# EasyEDA Pro project ProPrj_USB_CAN_Transceiver_Board_2026-08-12.epro

# Board PCB
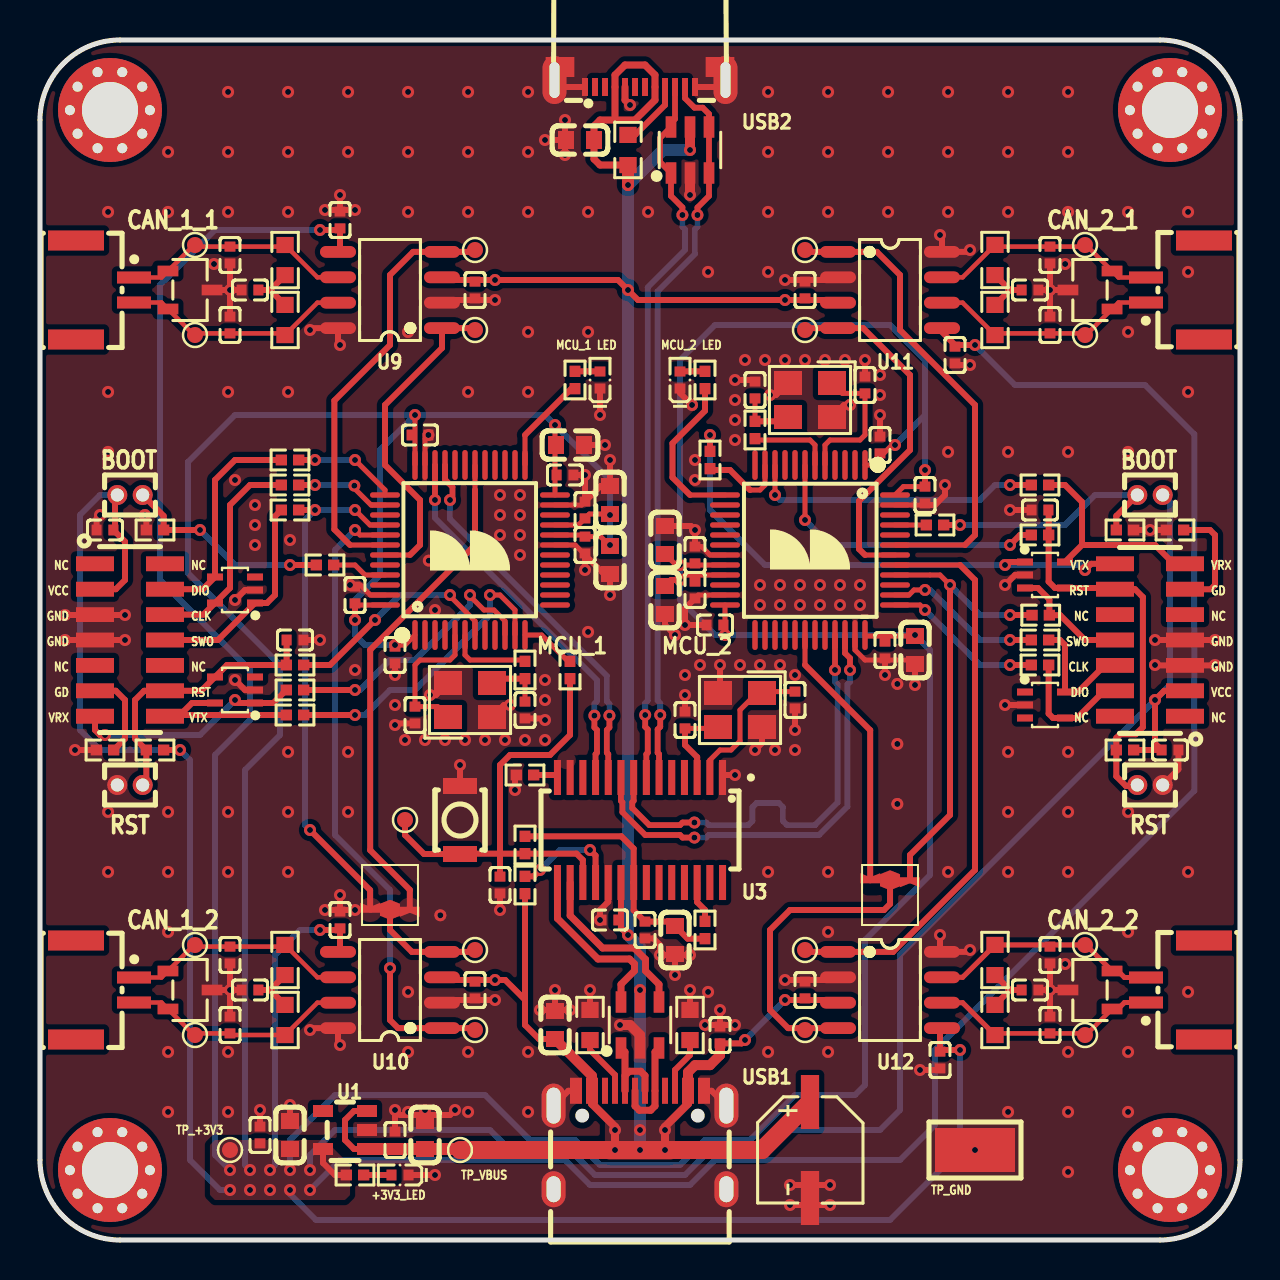
[diagram p0: board, top side]
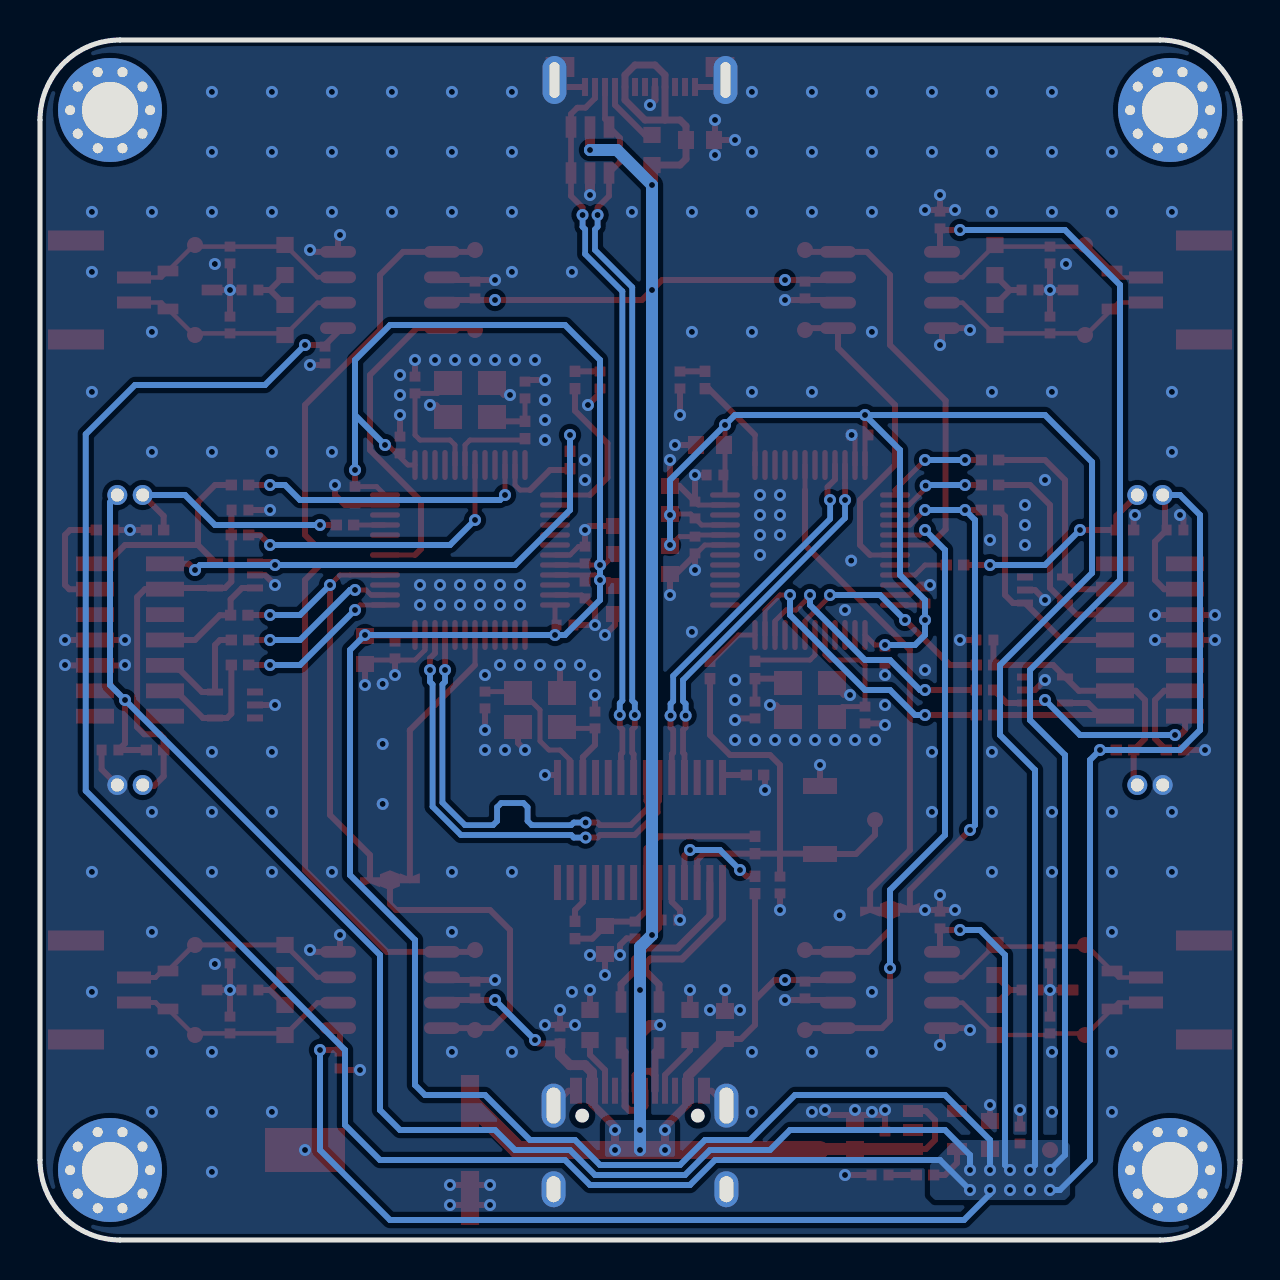
[diagram p1: board, bottom side, seen from below]

Outline 60 x 60 mm; copper layers: Top Layer, Inner1, Inner2, Bottom Layer. Coordinates in mm from the lower left corner of the outline.
Outline path: 0,56 0,4 arc(1.17,1.17) 4,0 56,0 arc(58.83,1.17) 60,4 60,56 arc(58.83,58.83) 56,60 4,60 arc(1.17,58.83) 0,56
Stack: Top Layer 0.035mm Outer layer thickness 1oz / Dielectric1 0.0994mm 3313 RC57% 4.2mil / Inner1 0.0152mm Inner layer thickness / Dielectric2 1.265mm 1.3mm H/HOZ Copper / Inner2 0.0152mm Inner layer thickness / Dielectric3 0.0994mm 3313 RC57% 4.2mil / Bottom Layer 0.035mm Outer layer thickness 1oz

## Design rules (mm)
net DP_P: DP_US
net DN_N: DP_US
net USB_D-: DP_US_PROT
net USB_D+: DP_US_PROT
net FE11S_DP3: DP_DS_3
net FE11S_DM3: DP_DS_3
net FE11S_DM1: DP_DS_1
net FE11S_DP1: DP_DS_1
net FE11S_DP2: DP_DS_2
net FE11S_DM2: DP_DS_2
net CAN_1_H_1: DP_CAN_1
net CAN_1_L_1: DP_CAN_1
net CAN_1_H_2: DP_CAN_2
net CAN_1_L_2: DP_CAN_2
net CAN_2_H_1: DP_CAN_3
net CAN_2_L_1: DP_CAN_3
net CAN_2_H_2: DP_CAN_4
net CAN_2_L_2: DP_CAN_4
template: Custom Config
spacing copperThickness1oz (default): track to track 0.127, other pairs 0.152 to 0.3
spacing copperThickness2oz: track to track 0.203, other pairs 0.152 to 0.3
track width copperThickness1oz (default): min 0.203, default 0.3, max 2.54
track width copperThickness2oz: min 0.203, default 0.254, max 2.54
differential pair DP_USB_90 (default): width min 0.127, default 0.291, max 2.54; gap min 0.152, default 0.203
differential pair DP_CAN_120: width min 0.127, default 0.224, max 2.54; gap min 0.152, default 2.54
via viaSize (default): diameter min 0.5, default 0.6, max 10; hole min 0.3, default 0.3, max 6.3
net CAN_1_H_1 uses DP_CAN_120
net CAN_1_L_1 uses DP_CAN_120
net CAN_1_H_2 uses DP_CAN_120
net CAN_1_L_2 uses DP_CAN_120
net CAN_2_H_1 uses DP_CAN_120
net CAN_2_L_1 uses DP_CAN_120
net CAN_2_H_2 uses DP_CAN_120
net CAN_2_L_2 uses DP_CAN_120
diff pair DP_CAN_1 uses DP_CAN_120
diff pair DP_CAN_2 uses DP_CAN_120
diff pair DP_CAN_3 uses DP_CAN_120
diff pair DP_CAN_4 uses DP_CAN_120

## Placement (name value [footprint] x y rotation side)
C1  10uF  [C0603]  19.25 5.25 270 top
C2  100nF  [C0402]  17.75 5 270 top
C3  10uF  [C0603]  12.5 5.25 270 top
C4  100nF  [C0402]  11 5.25 270 top
C5  100uF  [CAP-SMD_BD5.0-L5.3-W5.3-LS6.3-FD]  38.5 4.5 270 top
C6  10uF  [C0603]  25.75 10.75 270 top
C7  100nF  [C0402]  34 10.25 270 top
C8  100nF  [C0402]  28.5 16 0 top
C9  10uF  [C0603]  31.75 15 90 top
C10  100nF  [C0402]  30.25 15.5 90 top
C11  20pF  [C0402]  32.25 26 270 top
C12  20pF  [C0402]  37.75 27 90 top
C13  100nF  [C0402]  23 17.75 90 top
C14  10uF  [C0603]  27 55 0 top
C15  4.7uF  [C0603]  26.5 39.75 0 top
C16  100nF  [C0402]  26.25 38.25 180 top
C17  100nF  [C0402]  19 40.25 180 top
C18  100nF  [C0402]  15.75 32.25 270 top
C19  100nF  [C0402]  17.75 29.25 90 top
C20  1uF  [C0603]  28.5 37 270 top
C21  10nF  [C0402]  27.25 36.5 270 top
C22  1uF  [C0603]  28.5 34 90 top
C23  100nF  [C0402]  27.25 34.75 90 top
C24  100nF  [C0402]  12.75 30 180 top
C25  100nF  [C0402]  3.25 35.5 0 top
C26  20pF  [C0402]  18.75 26.25 90 top
C27  20pF  [C0402]  24.25 26.5 90 top
C28  4.7uF  [C0603]  43.75 29.5 270 top
C29  100nF  [C0402]  44.25 37.25 90 top
C30  100nF  [C0402]  42.25 29.5 90 top
C31  100nF  [C0402]  33.75 30.75 0 top
C32  100nF  [C0402]  42 39.75 270 top
C33  1uF  [C0603]  31.25 32 90 top
C34  10nF  [C0402]  32.75 32.5 90 top
C35  1uF  [C0603]  31.25 35 270 top
C36  100nF  [C0402]  32.75 34.25 270 top
C37  100nF  [C0402]  50 36.5 0 top
C38  100nF  [C0402]  56.5 24.5 180 top
C39  20pF  [C0402]  41.25 42.75 270 top
C40  20pF  [C0402]  35.75 42.5 270 top
C41  4.7pF  [C0402]  9.5 45.75 270 top
C42  100nF  [C0402]  21.75 47.5 90 top
C43  100nF  [C0402]  15 51 270 top
C44  4.7nF  [C0402]  10.5 47.5 0 top
C45  4.7pF  [C0402]  9.5 49.25 270 top
C46  4.7pF  [C0402]  9.5 10.75 270 top
C47  100nF  [C0402]  21.75 12.5 90 top
C48  100nF  [C0402]  15 16 270 top
C49  4.7nF  [C0402]  10.5 12.5 0 top
C50  4.7pF  [C0402]  9.5 14.25 270 top
C51  4.7pF  [C0402]  50.5 49.25 90 top
C52  100nF  [C0402]  38.25 47.5 270 top
C53  100nF  [C0402]  45.75 44.25 90 top
C54  4.7nF  [C0402]  49.5 47.5 180 top
C55  4.7pF  [C0402]  50.5 45.75 90 top
C56  4.7pF  [C0402]  50.5 14.25 90 top
C57  100nF  [C0402]  38.25 12.5 270 top
C58  100nF  [C0402]  45 9 90 top
C59  4.7nF  [C0402]  49.5 12.5 180 top
C60  4.7pF  [C0402]  50.5 10.75 90 top
CN1  RH-5019  [TESTPOINT-SMD_L3.8-W2.0_RH-5019]  46.75 4.5 0 top
CN2  WAFER-GH1.25-2PWB  [CONN-TH_2P-P1.25_XUNPU_WAFER-GH1.25-2PWB]  3.25 47.5 270 top
CN3  WAFER-GH1.25-2PWB  [CONN-TH_2P-P1.25_XUNPU_WAFER-GH1.25-2PWB]  3.25 12.5 270 top
CN4  WAFER-GH1.25-2PWB  [CONN-TH_2P-P1.25_XUNPU_WAFER-GH1.25-2PWB]  56.75 47.5 90 top
CN5  WAFER-GH1.25-2PWB  [CONN-TH_2P-P1.25_XUNPU_WAFER-GH1.25-2PWB]  56.75 12.5 90 top
D1  USBLC6-2SC6  [SOT-23-6_L2.9-W1.6-P0.95-LS2.8-BL]  30 10.75 0 top
D2  USBLC6-2SC6  [SOT-23-6_L2.9-W1.6-P0.95-LS2.8-BL]  32.5 54.5 0 top
D3  ESDALC6V1W5  [SOT-323-5_L2.0-W1.3-LS2.1-BL]  9.75 27.5 90 top
D4  ESDALC6V1W5  [SOT-323-5_L2.0-W1.3-LS2.1-BL]  9.75 32.5 90 top
D5  ESDALC6V1W5  [SOT-323-5_L2.0-W1.3-LS2.1-BL]  50.25 33.25 270 top
D6  ESDALC6V1W5  [SOT-323-5_L2.0-W1.3-LS2.1-BL]  50.25 26.75 270 top
D7  PESD2CANFD24V-TR  [SOT-23-3_L3.0-W1.7-P0.95-LS2.9-BR]  7.5 47.5 180 top
D8  PESD2CANFD24V-TR  [SOT-23-3_L3.0-W1.7-P0.95-LS2.9-BR]  7.5 12.5 180 top
D9  PESD2CANFD24V-TR  [SOT-23-3_L3.0-W1.7-P0.95-LS2.9-BR]  52.5 47.5 0 top
D10  PESD2CANFD24V-TR  [SOT-23-3_L3.0-W1.7-P0.95-LS2.9-BR]  52.5 12.5 0 top
H1  ZX-PZ1.27-1-2PZZ  [HDR-TH_2P-P1.27-V-M-2]  4.5 22.75 180 top
H2  ZX-PZ1.27-1-2PZZ  [HDR-TH_2P-P1.27-V-M-2]  4.5 37.25 0 top
H3  ZX-PZ1.27-1-2PZZ  [HDR-TH_2P-P1.27-V-M-2]  55.5 22.75 0 top
H4  ZX-PZ1.27-1-2PZZ  [HDR-TH_2P-P1.27-V-M-2]  55.5 37.25 180 top
J1  STLINK-V3MINI_STDC14  [HDR-SMD_14P-P1.27-V-M-R2-C7-LS5.3-1]  4.5 30 270 top
J2  STLINK-V3MINI_STDC14  [HDR-SMD_14P-P1.27-V-M-R2-C7-LS5.3-1]  55.5 30 90 top
K1  Jumper-3Pos-SMD  [JMP_ARROW_3PIN_SPECIFIC_CUSTOMIZATION]  17.5 17.25 90 top
K2  Jumper-3Pos-SMD  [JMP_ARROW_3PIN_SPECIFIC_CUSTOMIZATION]  42.5 17.25 270 top
LED1  XL-1005UGC  [LED0402-RD_GREEN]  18 3.25 180 top
MCU_1  STM32G474CET6  [LQFP-48_L7.0-W7.0-P0.50-LS9.0-BL]  21.5 34.5 0 top
MCU_2  STM32G474CET6  [LQFP-48_L7.0-W7.0-P0.50-LS9.0-BL]  38.5 34.5 180 top
R1  1kΩ  [R0402]  15.75 3.25 0 top
R2  5.1kΩ  [R0603]  27.5 10.75 90 top
R3  5.1kΩ  [R0603]  32.5 10.75 270 top
R4  10kΩ  [R0402]  33.25 15.5 90 top
R5  10kΩ  [R0402]  24.25 19.75 90 top
R6  1kΩ  [R0402]  26.5 28.5 90 top
R7  1kΩ  [R0402]  24.25 17.75 270 top
R8  2.7kΩ  [R0402]  24.25 23.25 0 top
R9  56kΩ  [R0603]  29.4 54.5 270 top
R10  10kΩ  [R0402]  5.75 24.5 0 top
R11  47Ω  [R0402]  14.25 33.75 180 top
R12  10kΩ  [R0402]  5.75 35.5 0 top
R13  100Ω  [R0402]  3.25 24.5 0 top
R14  47Ω  [R0402]  12.75 27.5 180 top
R15  47Ω  [R0402]  12.75 26.25 180 top
R16  47Ω  [R0402]  12.75 28.75 180 top
R17  1kΩ  [R0402]  26.75 43 270 top
R18  47Ω  [R0402]  12.5 36.5 180 top
R19  47Ω  [R0402]  12.5 39 180 top
R20  47Ω  [R0402]  12.5 37.75 180 top
R21  0Ω  [R0402]  24.25 28.5 90 top
R22  10kΩ  [R0402]  54.25 24.5 0 top
R23  47Ω  [R0402]  44.75 35.75 0 top
R24  10kΩ  [R0402]  54.25 35.5 180 top
R25  100Ω  [R0402]  56.75 35.5 0 top
R26  1kΩ  [R0402]  33.25 43 90 top
R27  47Ω  [R0402]  50.04 31.24 0 top
R28  47Ω  [R0402]  33.5 39 90 top
R29  47Ω  [R0402]  50 35.25 0 top
R30  47Ω  [R0402]  50 37.75 0 top
R31  47Ω  [R0402]  50 28.75 0 top
R32  47Ω  [R0402]  50 30 0 top
R33  0Ω  [R0402]  35.75 40.5 270 top
R34  60.4Ω  [R0603]  12.25 46 270 top
R35  60.4Ω  [R0603]  12.25 49 270 top
R36  60.4Ω  [R0603]  12.25 11 270 top
R37  60.4Ω  [R0603]  12.25 14 270 top
R38  60.4Ω  [R0603]  47.75 49 90 top
R39  60.4Ω  [R0603]  47.75 46 90 top
R40  60.4Ω  [R0603]  47.75 14 90 top
R41  60.4Ω  [R0603]  47.75 11 90 top
SW1  B3U-1000P  [KEY-SMD_B3U-1000PM]  21 21 90 top
TP1  -  [TESTPOINT_0.8MM]  21 4.5 0 top
TP2  -  [TESTPOINT_0.8MM]  9.5 4.5 0 top
TP3  -  [TESTPOINT_0.8MM]  18.25 21 0 top
TP4  -  [TESTPOINT_0.8MM]  21.75 45.5 180 top
TP5  -  [TESTPOINT_0.8MM]  7.75 45.25 0 top
TP6  -  [TESTPOINT_0.8MM]  21.75 49.5 180 top
TP7  -  [TESTPOINT_0.8MM]  7.75 49.75 0 top
TP8  -  [TESTPOINT_0.8MM]  21.75 10.5 0 top
TP9  -  [TESTPOINT_0.8MM]  7.75 10.25 0 top
TP10  -  [TESTPOINT_0.8MM]  21.75 14.5 0 top
TP11  -  [TESTPOINT_0.8MM]  7.75 14.75 0 top
TP12  -  [TESTPOINT_0.8MM]  38.25 49.5 0 top
TP13  -  [TESTPOINT_0.8MM]  52.25 49.75 0 top
TP14  -  [TESTPOINT_0.8MM]  38.25 45.5 0 top
TP15  -  [TESTPOINT_0.8MM]  52.25 45.25 0 top
TP16  -  [TESTPOINT_0.8MM]  38.25 14.5 0 top
TP17  -  [TESTPOINT_0.8MM]  52.25 14.75 0 top
TP18  -  [TESTPOINT_0.8MM]  38.25 10.5 0 top
TP19  -  [TESTPOINT_0.8MM]  52.25 10.25 0 top
U1  TLV75733PDBVR  [SOT-23-5_L2.9-W1.6-P0.95-LS2.8-BL]  15.25 5.5 90 top
U3  FE1.1S-BSOP28BCN  [SSOP-28_L9.9-W3.9-P0.635-LS6.0-BL-1]  30 20.5 180 top
U6  XL-1005UBC  [LED0402-RD_GREEN]  28 43 90 top
U8  XL-1005UBC  [LED0402-RD_GREEN]  32 43 90 top
U9  TCAN1044AVDRQ1  [SOIC-8_L4.9-W3.9-P1.27-LS6.0-BL]  17.5 47.5 90 top
U10  TCAN1044AVDRQ1  [SOIC-8_L4.9-W3.9-P1.27-LS6.0-BL]  17.5 12.5 90 top
U11  TCAN1044AVDRQ1  [SOIC-8_L4.9-W3.9-P1.27-LS6.0-BL]  42.5 47.5 270 top
U12  TCAN1044AVDRQ1  [SOIC-8_L4.9-W3.9-P1.27-LS6.0-BL]  42.5 12.5 270 top
U14  -  [M2.5]  3.49 3.49 0 top
U15  -  [M2.5]  56.49 3.49 0 top
U16  -  [M2.5]  3.49 56.49 0 top
U17  -  [M2.5]  56.49 56.49 0 top
USB1  U262-161N-4BVC11  [USB-3.1-SMD_U262-161N-4BVC11]  30 5 0 top
USB2  U261-121N-4BS2S  [USB-C-SMD_U261-121N-4BS2S]  30 58.15 180 top
X1  12MHz  [CRYSTAL-SMD_4P-L3.2-W2.5-BL]  35 26.5 180 top
X2  8MHz  [CRYSTAL-SMD_4P-L3.2-W2.5-BL]  21.5 27 0 top
X3  8MHz  [CRYSTAL-SMD_4P-L3.2-W2.5-BL]  38.5 42 180 top

## Footprints (pads in the part's own frame, mm; a bottom-side part is the same pattern mirrored in y, then rotated)
C0402
  rect 0.5x0.54 smd: 1(-0.42,0) 2(0.42,0)
C0603
  rect 0.8x0.9 smd: 1(-0.7,0) 2(0.7,0)
CAP-SMD_BD5.0-L5.3-W5.3-LS6.3-FD
  rect 2.7x0.91 smd: 1(-2.4,0) 2(2.4,0)
CONN-TH_2P-P1.25_XUNPU_WAFER-GH1.25-2PWB
  rect 0.6x1.7 smd: 1(-0.625,1.45) 2(0.625,1.45)
  rect 1x2.8 smd: 3(-2.475,-1.45) 4(2.475,-1.45)
CRYSTAL-SMD_4P-L3.2-W2.5-BL
  rect 1.4x1.2 smd: 1(-1.1,-0.85) 2(1.1,-0.85) 3(1.1,0.85) 4(-1.1,0.85)
HDR-SMD_14P-P1.27-V-M-R2-C7-LS5.3-1
  rect 0.74x1.9 smd: 1(-3.81,-1.75) 2(-3.81,1.75) 3(-2.54,-1.75) 4(-2.54,1.75) 5(-1.27,-1.75) 6(-1.27,1.75) 7(0,-1.75) 8(0,1.75) 9(1.27,-1.75) 10(1.27,1.75) 11(2.54,-1.75) 12(2.54,1.75) 13(3.81,-1.75) 14(3.81,1.75)
HDR-TH_2P-P1.27-V-M-2
  round 1 hole 0.65: 1(-0.635,0) 2(0.635,0)
JMP_ARROW_3PIN_SPECIFIC_CUSTOMIZATION
  custom 0.5x1 smd: 1(-0.738,0.995) 3(-0.738,-0.992)
  custom 1x1 smd: 2(-0.738,0.002)
KEY-SMD_B3U-1000PM
  rect 0.8x1.7 smd: 1(-1.7,0) 2(1.7,0)
LED0402-RD_GREEN
  rect 0.5x0.54 smd: 1(-0.425,0) 2(0.425,0)
LQFP-48_L7.0-W7.0-P0.50-LS9.0-BL
  oval 0.27x1.5 smd: 1(-2.75,-4.25) 2(-2.25,-4.25) 3(-1.75,-4.25) 4(-1.25,-4.25) 5(-0.75,-4.25) 6(-0.25,-4.25) 7(0.25,-4.25) 8(0.75,-4.25) 9(1.25,-4.25) 10(1.75,-4.25) 11(2.25,-4.25) 12(2.75,-4.25) 25(2.75,4.25) 26(2.25,4.25) 27(1.75,4.25) 28(1.25,4.25) 29(0.75,4.25) 30(0.25,4.25) 31(-0.25,4.25) 32(-0.75,4.25) 33(-1.25,4.25) 34(-1.75,4.25) 35(-2.25,4.25) 36(-2.75,4.25)
  oval 1.5x0.27 smd: 13(4.25,-2.75) 14(4.25,-2.25) 15(4.25,-1.75) 16(4.25,-1.25) 17(4.25,-0.75) 18(4.25,-0.25) 19(4.25,0.25) 20(4.25,0.75) 21(4.25,1.25) 22(4.25,1.75) 23(4.25,2.25) 24(4.25,2.75) 37(-4.25,2.75) 38(-4.25,2.25) 39(-4.25,1.75) 40(-4.25,1.25) 41(-4.25,0.75) 42(-4.25,0.25) 43(-4.25,-0.25) 44(-4.25,-0.75) 45(-4.25,-1.25) 46(-4.25,-1.75) 47(-4.25,-2.25) 48(-4.25,-2.75)
M2.5
  round 1 hole 0.5: 1(-2,0) 1(-1.618,1.175) 1(-1.618,-1.175) 1(-0.618,1.902) 1(-0.618,-1.902) 1(0.618,1.902) 1(0.618,-1.902) 1(1.618,1.175) 1(1.618,-1.175) 1(2,0)
  round 5.2 hole 2.8: 1(0.005,0.009)
R0402
  rect 0.566x0.54 smd: 1(-0.433,0) 2(0.433,0)
R0603
  rect 0.806x0.864 smd: 1(-0.753,0) 2(0.753,0)
SOIC-8_L4.9-W3.9-P1.27-LS6.0-BL
  oval 0.588x1.8 smd: 1(-1.905,-2.6) 2(-0.635,-2.6) 3(0.635,-2.6) 4(1.905,-2.6) 5(1.905,2.6) 6(0.635,2.6) 7(-0.635,2.6) 8(-1.905,2.6)
SOT-23-3_L3.0-W1.7-P0.95-LS2.9-BR
  rect 1.038x0.532 smd: 1(1.101,-0.95) 2(1.101,0.95) 3(-1.101,0)
SOT-23-5_L2.9-W1.6-P0.95-LS2.8-BL
  rect 0.6x1 smd: 1(-0.95,-1.1) 2(0,-1.1) 3(0.95,-1.1) 4(0.95,1.1) 5(-0.95,1.1)
SOT-23-6_L2.9-W1.6-P0.95-LS2.8-BL
  rect 0.532x1.072 smd: 1(-0.95,-1.149) 2(0,-1.149) 3(0.95,-1.149) 4(0.95,1.149) 5(0,1.149) 6(-0.95,1.149)
SOT-323-5_L2.0-W1.3-LS2.1-BL
  rect 0.35x0.8 smd: 1(-0.651,-1) 2(-0.001,-1) 3(0.649,-1) 4(0.651,1) 5(-0.649,1)
SSOP-28_L9.9-W3.9-P0.635-LS6.0-BL-1
  rect 0.35x1.751 smd: 1(-4.128,-2.626) 2(-3.493,-2.626) 3(-2.857,-2.626) 4(-2.223,-2.626) 5(-1.587,-2.626) 6(-0.953,-2.626) 7(-0.318,-2.626) 8(0.318,-2.626) 9(0.953,-2.626) 10(1.587,-2.626) 11(2.223,-2.626) 12(2.857,-2.626) 13(3.493,-2.626) 14(4.128,-2.626) 15(4.128,2.626) 16(3.493,2.626) 17(2.857,2.626) 18(2.223,2.626) 19(1.587,2.626) 20(0.953,2.626) 21(0.318,2.626) 22(-0.318,2.626) 23(-0.953,2.626) 24(-1.587,2.626) 25(-2.223,2.626) 26(-2.857,2.626) 27(-3.493,2.626) 28(-4.128,2.626)
TESTPOINT-SMD_L3.8-W2.0_RH-5019
  rect 4x2.2 smd: 1(0,0)
TESTPOINT_0.8MM
  round 0.8 smd: 1(0,0)
USB-3.1-SMD_U262-161N-4BVC11
  oval 1.2x2.2 hole 0.7x1.8: 13(4.32,1.719) 16(-4.32,1.719)
  oval 1.2x1.8 hole 0.7x1.3: 14(4.32,-2.462) 15(-4.32,-2.462)
  rect 0.6x1.3 smd: A1B12(-3.2,2.462) A4B9(-2.4,2.462) B1A12(3.2,2.462) B4A9(2.4,2.462)
  rect 0.3x1.3 smd: A5(-1.25,2.462) A6(-0.25,2.462) A7(0.25,2.462) A8(1.25,2.462) B5(1.75,2.462) B6(0.75,2.462) B7(-0.75,2.462) B8(-1.75,2.462)
USB-C-SMD_U261-121N-4BS2S
  oval 1.2x2.4 hole 0.5x1.8: 25(-4.275,0.15) 26(4.275,0.15)
  rect 1.43x1 smd: 25(-4,-0.5) 26(4,-0.5)
  rect 0.3x0.9 smd: A1(2.75,0.5) A2(2.25,0.5) A3(1.75,0.5) A4(1.25,0.5) A5(-1.25,0.5) A6(-1.75,0.5) A7(-2.25,0.5) A12(-2.75,0.5) B9(-0.75,0.5) B10(-0.25,0.5) B11(0.25,0.5) B12(0.75,0.5)

## Nets
+3V3: C3.2 C4.2 C15.1 C16.2 C17.2 C18.2 C19.2 C20.2 C21.2 C22.2 C23.2 C25.2 C28.1 C29.2 C30.2 C31.2 C32.2 C33.2 C34.2 C35.2 C36.2 C38.2 C43.2 C48.2 C53.2 C58.2 H2.1 H4.1 J1.3 J2.3 MCU_1.1 MCU_1.20 MCU_1.21 MCU_1.24 MCU_1.36 MCU_1.48 MCU_2.1 MCU_2.20 MCU_2.21 MCU_2.24 MCU_2.36 MCU_2.48 R1.1 R10.2 R22.2 TP2.1 U1.5 U9.5 U10.5 U11.5 U12.5
+3V3_FE11S: C9.2 C10.2 R4.1 R5.2 U3.21
GND: C1.1 C2.1 C3.1 C4.1 C5.2 C6.1 C7.1 C8.1 C9.1 C10.1 C11.1 C12.1 C13.1 C14.1 C15.2 C16.1 C17.1 C18.1 C19.1 C20.1 C21.1 C22.1 C23.1 C24.1 C25.1 C26.1 C27.1 C28.2 C29.1 C30.1 C31.1 C32.1 C33.1 C34.1 C35.1 C36.1 C37.1 C38.1 C39.1 C40.1 C41.1 C42.1 C43.1 C44.1 C45.2 C46.1 C47.1 C48.1 C49.1 C50.2 C51.1 C52.1 C53.1 C54.1 C55.2 C56.1 C57.1 C58.1 C59.1 C60.2 CN1.1 D1.2 D2.2 D3.2 D4.2 D5.2 D6.2 D7.3 D8.3 D9.3 D10.3 H1.2 H3.2 J1.5 J1.7 J2.5 J2.7 LED1.1 MCU_1.19 MCU_1.23 MCU_1.35 MCU_1.47 MCU_2.19 MCU_2.23 MCU_2.35 MCU_2.47 R2.2 R3.1 R8.1 R12.1 R13.1 R24.1 R25.1 SW1.2 U1.2 U3.1 U3.19 U6.1 U8.1 U9.2 U9.8 U10.2 U10.8 U11.2 U11.8 U12.2 U12.8 USB1.13 USB1.14 USB1.15 USB1.16 USB1.A1B12 USB1.B1A12 USB2.25 USB2.26 USB2.A1 USB2.A12 USB2.B12 X1.2 X1.4 X2.2 X2.4 X3.2 X3.4
VBUS: C1.2 C2.2 C5.1 C6.2 C7.2 C8.2 C14.2 C42.2 C47.2 C52.2 C57.2 D1.5 D2.5 R7.2 R9.2 TP1.1 U1.1 U1.3 U3.20 U9.3 U10.3 U11.3 U12.3 USB1.A4B9 USB1.B4A9 USB2.A4 USB2.B9
CAN_1_H_1: C41.2 CN2.2 D7.2 R34.2 TP5.1 U9.7
CAN_1_H_2: C46.2 CN3.2 D8.2 R36.2 TP9.1 U10.7
CAN_1_L_1: C45.1 CN2.1 D7.1 R35.1 TP7.1 U9.6
CAN_1_L_2: C50.1 CN3.1 D8.1 R37.1 TP11.1 U10.6
CAN_2_H_1: C51.2 CN4.2 D9.2 R38.2 TP13.1 U11.7
CAN_2_H_2: C56.2 CN5.2 D10.2 R40.2 TP17.1 U12.7
CAN_2_L_1: C55.1 CN4.1 D9.1 R39.1 TP15.1 U11.6
CAN_2_L_2: C60.1 CN5.1 D10.1 R41.1 TP19.1 U12.6
DN_N: D1.1 USB1.A7 USB1.B7
DP_P: D1.3 USB1.A6 USB1.B6
FE11S_DM1: MCU_1.33 U3.10
FE11S_DM2: MCU_2.33 U3.8
FE11S_DM3: D2.3 D2.4 U3.6 USB2.A7
FE11S_DP1: MCU_1.34 U3.11
FE11S_DP2: MCU_2.34 U3.9
FE11S_DP3: D2.1 D2.6 U3.7 USB2.A6
FE11S_XIN: C11.2 U3.3 X1.3
FE11S_XOUT: C12.2 U3.2 X1.1
FE11S_XRSTJ: MCU_1.12 R6.2
MCU_1_BOOT0: MCU_1.45 R11.1
MCU_1_CAN_RX_1: MCU_1.42 TP6.1 U9.4
MCU_1_CAN_RX_2: K1.2 TP10.1 U10.4
MCU_1_CAN_TX_1: MCU_1.43 TP4.1 U9.1
MCU_1_CAN_TX_2: MCU_1.41 TP8.1 U10.1
MCU_1_LPUART1_RX: MCU_1.11 R15.1
MCU_1_LPUART1_TX: MCU_1.10 R14.1
MCU_1_NRST: MCU_1.7 R16.1
MCU_1_OSC_IN: C26.2 MCU_1.5 X2.1
MCU_1_OSC_OUT: MCU_1.6 R21.2
MCU_1_SWCLK: MCU_1.38 R20.1
MCU_1_SWDIO: MCU_1.37 R19.1
MCU_1_SWO: K1.1 MCU_1.40 R18.1
MCU_1_T_NRST: C24.2 D3.4 H1.1 J1.12 R10.1 R16.2
MCU_1_T_SWCLK: D4.5 J1.6 R20.2
MCU_1_T_SWDIO: D4.4 J1.4 R19.2
MCU_1_T_SWO: D4.1 J1.8 R18.2
MCU_1_T_VCP_RX: D3.1 J1.13 R14.2
MCU_1_T_VCP_TX: D3.5 J1.14 R15.2
MCU_2_BOOT0: MCU_2.45 R23.1
MCU_2_CAN_RX_1: MCU_2.42 TP14.1 U11.4
MCU_2_CAN_RX_2: K2.2 TP18.1 U12.4
MCU_2_CAN_TX_1: MCU_2.43 TP12.1 U11.1
MCU_2_CAN_TX_2: MCU_2.41 TP16.1 U12.1
MCU_2_LPUART1_RX: MCU_2.11 R28.1
MCU_2_LPUART1_TX: MCU_2.10 R30.1
MCU_2_NRST: MCU_2.7 R29.1
MCU_2_OSC_IN: C39.2 MCU_2.5 X3.1
MCU_2_OSC_OUT: MCU_2.6 R33.2
MCU_2_SWCLK: MCU_2.38 R32.1
MCU_2_SWDIO: MCU_2.37 R31.1
MCU_2_SWO: K2.1 MCU_2.40 R27.1
MCU_2_T_NRST: C37.2 D5.4 H3.1 J2.12 R22.1 R29.2
MCU_2_T_SWCLK: D6.5 J2.6 R32.2
MCU_2_T_SWDIO: D6.4 J2.4 R31.2
MCU_2_T_SWO: D5.3 J2.8 R27.2
MCU_2_T_VCP_RX: D5.5 J2.13 R30.2
MCU_2_T_VCP_TX: D5.1 J2.14 R28.2
USB_D+: D1.4 U3.16
USB_D-: D1.6 U3.15
$3N8127: R8.2 U3.14
$3N8300: C13.2 R5.1 R6.1 SW1.1 TP3.1 U3.17
$3N9166: R4.2 U3.26
$3N10248: R7.1 U3.18
$3N19788: R3.2 USB1.B5
$3N19847: R2.1 USB1.A5
$3N24491: R9.1 USB2.A5
$6N2708: C27.2 R21.1 X2.3
$6N3661: H2.2 R11.2 R12.2
$6N4541: J1.11 R13.2
$6N15318: K1.3 MCU_1.30
$6N22154: R17.1 U6.2
$6N22191: MCU_1.25 R17.2
$7N3652: C44.2 R34.1 R35.2
$7N4592: C49.2 R36.1 R37.2
$7N5135: C54.2 R38.1 R39.2
$7N5660: C59.2 R40.1 R41.2
$8N1903: LED1.2 R1.2
$11N2708: C40.2 R33.1 X3.3
$11N3661: H4.2 R23.2 R24.2
$11N4541: J2.11 R25.2
$11N20046: K2.3 MCU_2.30
$11N27268: MCU_2.13 R26.1
$11N27273: R26.2 U8.2

Pads without a net: CN2 3 4; CN3 3 4; CN4 3 4; CN5 3 4; D3 3; D4 3; D6 1 3; J1 1 2 9 10; J2 1 2 9 10; MCU_1 2 3 4 8 9 13 14 15 16 17 18 22 26 27 28 29 31 32 39 44 46; MCU_2 2 3 4 8 9 12 14 15 16 17 18 22 25 26 27 28 29 31 32 39 44 46; U1 4; U3 4 5 12 13 22 23 24 25 27 28; U14 1; U15 1; U16 1; U17 1; USB1 A8 B8; USB2 A2 A3 B10 B11

## Via types
v1: diameter 0.6, hole 0.3, Top Layer to Bottom Layer, 368 vias

## Routing (per net, layer and track width the routed paths; a pad name or vN(x,y) marks a point on that pad's centre or on a via; arc(x,y) is an arc through that point)
+3V3: length 546
  Top Layer w0.25: v1(25.75,40.75) MCU_1.24 ; MCU_1.36 v1(18.75,41.25) ; MCU_1.21 26.92,35.75 C21.2 27.47,36.3 C20.2 ; MCU_1.1 18.25,29.75 v1(17.75,29.75) ; MCU_2.20 v1(32,33.75) 31.8,33.75 C35.2 ; MCU_2.36 41.3,30.2 C28.1 ; MCU_1.20 27.17,35.25 C23.2 28.03,35.17 C22.2 ; v1(32,33) 32.25,33.25 MCU_2.21 ; C29.2 43.17,37.67 MCU_2.48 ; MCU_2.1 41.6,38.75 42.6,39.75 v1(42.75,39.75) ; MCU_1.48 15.83,31.75 ; MCU_2.24 v1(34.25,30.25)
  Top Layer w0.3: v1(7,24.5) R10.2 ; C53.2 45.83,44.75 v1(46.75,44.75) ; J2.3 56.21,27.46 v1(55.75,27) 55.75,24.83 C38.2 R22.2 ; J1.3 3.79,32.54 4.25,33 4.25,34.92 C25.2 3.75,35.58 3.75,37.14 H2.1 ; U12.5 45,10.5 C58.2 45.08,9.5 v1(46,9.5) ; 15.83,31.75 C18.2 v1(15.75,31) ; v1(14,50.5) 14.92,50.5 C43.2 15,49.5 U9.5 ; U10.5 15,14.5 C48.2 14.92,15.5 v1(14,15.5) ; R1.1 14.75,3.25 14.15,3.85 U1.5 ; C29.2 v1(44.25,38.5) ; C33.2 31.55,33 v1(32,33) ; 45.75,44.75 45,45.5
  Bottom Layer w0.3: v1(13.5,3.5) 13.5,4.25 14.75,5.5 22.5,5.5 23.5,4.5 26.5,4.5 27.75,3.25 32.25,3.25 33.5,4.5 36.25,4.5 37.25,5.5 42,5.5 43,6.5 43,14.25 v1(55.75,27) 56.5,27.75 56.5,36.89 H4.1 ; v1(18.75,41.25) 25.25,41.25 v1(25.75,40.75) 28.5,38 C20.2 C22.2 ; v1(18.75,41.25) 9.75,41.25 7.4,38.9 7.4,33.35 12,28.75 12,25.25 10.25,23.5 10.25,3.75 v1(10.5,3.5) ; v1(18.75,41.25) 17,39.5 17,33.25 15.75,32 v1(15.75,31) 15.75,30.25 16.25,29.75 v1(17.75,29.75) ; 43.8,30.25 v1(43.75,30.25) ; v1(43.75,30.25) v1(34.25,30.25) 33.75,30.25 32,32 v1(32,33) v1(32,33.75) 32,44 33.75,45.75 42.5,45.75 44.25,44 44.25,41.25 ; v1(43.75,30.25) 44.5,29.5 44.5,18.25 41.25,15 41.25,7.75 40.75,7.25 37.75,7.25 35.5,5 33.25,5 32,3.75 28,3.75 26.75,5 24.5,5 22.25,7.25 14.75,7.25 12.5,5 v1(12.5,3.5) ; v1(9.5,2.5) 9,2.5 7.5,4 7.5,24 v1(7,24.5) 3,24.5 2,25.5 2,36.25 3,37.25 H2.1 ; v1(14,50.5) 8.75,50.5 6,47.75 6,33 10.5,28.5 10.5,26 8.75,24.25 8.75,4.25 v1(9.5,3.5) ; v1(14,15.5) 13,15.5 11.75,14.25 11.75,3.75 v1(11.5,3.5) ; v1(13.5,2.5) 15,4 26.25,4 27.5,2.75 32.5,2.75 33.75,4 43,4 44.75,5.75 44.75,9.5 57.71,22.46 57.71,40.29 55.25,42.75 48.75,42.75 v1(46.75,44.75) ; 44.25,41.25 v1(42.75,39.75) ; 44.25,41.25 v1(44.25,38.5) ; v1(12.5,2.5) 12.5,2.3 13.8,1 42.5,1 46,4.5 v1(46,9.5)
  vias: v1(10.5,2.5) v1(11.5,2.5) v1(28.5,36.25) v1(28.5,34.75)
+3V3_FE11S: length 12.9
  Top Layer w0.3: R5.2 29.07,20.18 29.68,19.57 U3.21 29.68,16.49 C10.2 31.53,15.92 C9.2 32.38,15.07 R4.1
GND: length 161.2
  Top Layer w0.25: C29.1 44.17,36.75 MCU_2.47 ; MCU_1.35 19.25,40.08 v1(19.42,40.25) ; MCU_1.23 27.08,36.75 C21.1 ; MCU_2.35 40.75,29.5 41.25,29 43.55,29 C28.2 ; MCU_1.47 16.52,32.25 16.02,32.75 v1(15.5,32.75) ; C23.1 27.18,34.33 26.76,34.75 MCU_1.19 ; C36.1 33.08,34.67 33.5,34.25 MCU_2.19 ; MCU_2.23 32.92,32.25 C34.1
  Top Layer w0.3: v1(37.5,1.75) v1(39.5,1.75) ; v1(9.75,32) 10.25,32.5 D4.2 ; v1(9.5,47.5) C44.1 ; v1(9.5,47.5) C45.2 ; v1(9.5,47.5) D7.3 ; v1(9.5,47.5) C41.1 ; C36.1 v1(32.75,35.5) 32.55,35.7 C35.1 ; v1(25.75,12.5) 25.75,11.5 ; 25.75,11.5 v1(26.5,11.5) ; 25.75,11.5 v1(25,11.5) ; C2.1 v1(17.75,6.5) 18,6.25 19.25,6.25 ; X2.4 19.8,27.25 v1(19.5,27.25) ; v1(23,16.5) C13.1 ; R8.1 23.75,23.18 v1(23.75,22.5) ; v1(34,11.5) 34,10.75 ; 34,10.75 C7.1 ; 34,10.75 v1(33.25,10.75) ; 34,10.75 v1(34.75,10.75) ; U8.1 32,42.35 v1(32.6,41.75) ; C50.2 v1(9.5,12.5) ; v1(9.5,12.5) C46.1 ; v1(9.5,12.5) C49.1 ; v1(9.5,12.5) D8.3 ; v1(31.75,30.25) 31.25,30.75 C33.1 ; X3.2 36.8,42.25 v1(36.5,42.25) ; D5.2 48.75,33.25 v1(48.25,32.75) ; USB2.25 33.93,57.65 USB2.A12 ; 26.25,55 v1(26.25,56) ; 26.25,55 v1(26.25,54.25) ; 26.25,55 C14.1 ; 26.25,55 v1(25.25,55) ; C43.1 15.08,51.5 v1(15.75,51.5) ; C43.1 14.92,51.5 v1(14.25,51.5) ; C43.1 v1(15,52.25) ; U11.2 39.76,48 v1(37.25,48) ; 27.25,34.25 C23.1 ; 27.25,34.25 28.2,33.3 C22.1 v1(28.5,32.25) ; 27.25,34.25 v1(27.25,33.5) ; v1(55.75,28.75) 55.77,28.73 J2.5 58.73,28.73 v1(58.75,28.75) ; U12.2 39.76,13 v1(37.25,13) ; v1(50.5,47.5) D9.3 ; v1(50.5,47.5) C55.2 ; v1(50.5,47.5) C54.1 ; v1(50.5,47.5) C51.1 ; C40.1 35.67,43 v1(34.75,43) ; R12.1 5.32,36.18 v1(5.25,36.25) ; USB1.16 26.42,7.46 USB1.A1B12 ; R2.2 v1(27.5,12.5) ; U9.2 20.24,47 v1(22.75,47) ; C25.1 2.83,36.08 v1(3,36.25) ; v1(37.5,2.75) v1(39.5,2.75) ; 15,16.5 C48.1 ; 15,16.5 v1(15.75,16.5) ; 15,16.5 v1(14.25,16.5) ; 15,16.5 v1(15,17.25) ; X2.2 23.2,26.75 v1(23.5,26.75) ; v1(50.5,12.5) D10.3 ; v1(50.5,12.5) C60.2 ; v1(50.5,12.5) C56.1 ; v1(50.5,12.5) C59.1 ; v1(4.25,30) J1.7 v1(1.25,30) ; v1(46.5,43.75) 45.83,43.75 C53.1 ; v1(32.25,27.25) C11.1 ; v1(9.75,28) 10.25,27.5 D3.2 ; v1(40.5,41.75) 40.2,41.75 X3.4 ; v1(25.25,26) 25.17,26.08 C27.1 ; v1(28,41.25) U6.1 ; v1(45,50.25) 45.1,50.15 U11.8 46.41,49.41 v1(46.5,49.5) ; USB2.26 26.07,57.65 USB2.A1 ; 19.25,6.25 20.5,6.25 v1(20.75,6.5) ; 19.25,6.25 v1(19.25,6.5) ; 19.25,6.25 C1.1 ; v1(19.75,3.25) LED1.1 ; v1(45,15.25) 45,14.5 U12.8 46.41,14.41 v1(46.5,14.5) ; v1(58.75,30) J2.7 v1(55.75,30) ; v1(48.5,36.5) C37.1 ; v1(34,28.75) 34,27.45 X1.2 ; v1(42.25,28.25) C30.1 ; v1(42,41.25) C32.1 ; C31.1 v1(32.25,30.75) 32.25,31.58 C34.1 ; C39.1 v1(41.25,44) ; C24.1 14.1,30 ; U10.2 20.24,12 v1(22.75,12) ; C29.1 44.33,36.75 44.75,36.75 45.25,37.25 v1(45.25,37.75) ; C16.1 v1(27.25,38.25) C21.1 28.03,37.7 C20.1 v1(28.5,39) ; 31.75,14.25 v1(31,14.25) 31,14.75 30.67,15.08 C10.1 ; 31.75,14.25 C9.1 ; 31.75,14.25 v1(31.75,13.25) ; 31.75,14.25 v1(32.5,14.25) ; v1(13.5,45.5) 13.59,45.59 U9.8 14.9,44.85 v1(15,44.75) ; v1(34.75,23.25) 34.25,23.25 U3.1 ; C12.1 v1(37.75,25.5) ; USB1.13 33.58,7.46 USB1.B1A12 ; C58.1 44.92,8.5 v1(44,8.5) ; v1(35.75,24.5) 36.1,24.85 X1.4 ; C26.1 17.83,25.83 v1(17.75,25.75) ; R24.1 v1(55.5,35.5) R25.1 ; v1(32.5,12.5) R3.1 ; v1(21,23.75) SW1.2 ; H3.2 56.92,23.53 C38.1 ; v1(28,16) 28,16.5 28.41,16.91 U3.19 ; v1(28.25,39.75) C15.2 ; v1(1.25,31.25) v1(4.25,31.25) ; v1(48.25,26.75) 49.25,26.75 ; v1(15,9.75) 14.9,9.85 U10.8 13.59,10.59 v1(13.5,10.5) ; v1(17.75,28.25) C19.1 ; v1(11,6.5) C4.1 ; v1(1.75,24.5) R13.1 ; v1(43.75,27.75) C28.2 ; v1(12.5,6.75) C3.1
  Top Layer w0.35: v1(29.5,56.75) 29.25,57 USB2.B12
  Top Layer w0.5: v1(29,10.75) 29.5,10.75 30,10.25 D1.2 ; v1(32.5,52.25) D2.2
  vias: v1(3.4,51.4) v1(3.4,42.4) v1(3.4,39.4) v1(3.4,21.4) v1(3.4,18.4) v1(6.4,54.4) v1(6.4,51.4) v1(6.4,21.4) v1(6.4,18.4) v1(6.4,15.4) v1(6.4,9.4) v1(6.4,6.4) v1(8.7,48.8) v1(9.4,57.4) v1(9.4,54.4) v1(9.4,51.4) v1(9.4,42.4) v1(9.4,21.4) v1(9.4,18.4) v1(9.4,9.4) v1(9.4,6.4) v1(9.75,38) v1(10.75,36.75) v1(10.75,35.75) v1(10.75,34.75) v1(12.4,57.4) v1(12.4,54.4) v1(12.4,51.4) v1(12.4,42.4) v1(12.4,24.4) v1(12.4,21.4) v1(12.4,18.4) v1(12.5,35) v1(14,30) v1(15.4,57.4) v1(15.4,54.4) v1(15.4,24.4) v1(15.4,21.4) v1(15.75,28.5) v1(17.75,26.75) v1(18.25,25) v1(18.4,57.4) v1(18.4,54.4) v1(18.4,51.4) v1(18.4,45.4) v1(18.4,12.4) v1(18.4,9.4) v1(18.4,6.4) v1(19.25,25) v1(19.44,33.97) v1(19.75,31.5) v1(20.02,16.24) v1(20.25,25) v1(21.25,25) v1(21.4,57.4) v1(21.4,54.4) v1(21.4,51.4) v1(21.4,42.4) v1(21.4,9.4) v1(21.4,6.4) v1(22.25,25) v1(23,37.25) v1(23,36.25) v1(23,35.25) v1(23.25,25) v1(24,37.25) v1(24,36.25) v1(24,35.25) v1(24,34.25) v1(24.25,25) v1(24.4,57.4) v1(24.4,54.4) v1(24.4,51.4) v1(24.4,45.4) v1(24.4,42.4) v1(24.4,9.4) v1(24.4,6.4) v1(25.25,28) v1(25.25,27) v1(25.25,25) v1(27.4,51.4) v1(27.4,45.4) v1(27.4,30.4) v1(30.4,51.4) v1(32.25,28.25) v1(32.75,39) v1(32.75,38) v1(33,28.75) v1(33.4,48.4) v1(33.4,12.4) v1(34.75,42) v1(34.75,41) v1(34.75,40) v1(35,28.75) v1(35.25,44) v1(36,32.75) v1(36,31.75) v1(36,28.75) v1(36.25,44) v1(36.4,57.4) v1(36.4,54.4) v1(36.4,51.4) v1(36.4,48.4) v1(36.4,18.4) v1(36.4,9.4) v1(36.75,24.5) v1(37,32.75) v1(37,31.75) v1(37,28.75) v1(37.25,44) v1(37.75,28.25) v1(37.75,24.5) v1(38,32.75) v1(38,31.75) v1(38.25,44) v1(39,32.75) v1(39,31.75) v1(39.25,44) v1(39.4,57.4) v1(39.4,54.4) v1(39.4,51.4) v1(39.4,18.4) v1(39.4,15.4) v1(39.4,9.4) v1(40,32.75) v1(40,31.75) v1(40.25,44) v1(41,32.75) v1(41,31.75) v1(42,43.25) v1(42,42.25) v1(42.4,57.4) v1(42.4,54.4) v1(42.4,51.4) v1(42.87,27.8) v1(42.87,24.8) v1(42.87,21.8) v1(45.4,57.4) v1(45.4,54.4) v1(45.4,51.4) v1(45.4,39.4) v1(45.4,18.4) v1(46.75,4.5) v1(48.4,57.4) v1(48.4,54.4) v1(48.4,51.4) v1(48.4,39.4) v1(48.4,24.4) v1(48.4,21.4) v1(48.4,18.4) v1(48.4,6.4) v1(51.26,48.8) v1(51.26,13.8) v1(51.4,57.4) v1(51.4,54.4) v1(51.4,51.4) v1(51.4,39.4) v1(51.4,24.4) v1(51.4,21.4) v1(51.4,18.4) v1(51.4,9.4) v1(51.4,6.4) v1(51.4,3.4) v1(54.4,51.4) v1(54.4,45.4) v1(54.4,39.4) v1(54.4,21.4) v1(54.4,15.4) v1(54.4,9.4) v1(54.4,6.4) v1(57.4,51.4) v1(57.4,48.4) v1(57.4,42.4) v1(57.4,18.4) v1(57.4,12.4)
VBUS: length 152.1
  Top Layer w0.3: R7.2 24.25,12.01 ; 24.25,12.01 24.25,10.75 24.95,10.05 C6.2 ; 24.25,12.01 23.26,13 v1(22.75,13) 20.24,13 U10.3 ; v1(37.25,12) 39.75,12 39.88,11.87 U12.3 ; U3.20 29.05,15.6 v1(29.4,15.25) ; C7.2 35.08,9.83 v1(35.25,10) ; U9.3 20.24,48 v1(22.75,48) 28.9,48 v1(29.4,47.5) 29.9,47 v1(37.25,47) 39.76,47 U11.3 ; U1.3 15.7,6.45 15.25,6 15.25,5 15.7,4.55 U1.1
  Top Layer w0.35: 28.75,56 29.75,56 30.75,57 USB2.B9 30.75,58.25 30.25,58.75 29.25,58.75 28.75,58.25 USB2.A4 28.75,56 ; 28.75,56 28,56 27.7,55.7 C14.2 27.7,54.05 28,53.75 29.4,53.75 R9.2
  Top Layer w0.4: USB1.A4B9 27.6,6.81 28.75,5.66 28.75,4.75 28.5,4.5 28.5,4.25 ; 31.5,4.25 31.5,4.5 31.25,4.75 31.25,5.66 32.4,6.81 USB1.B4A9
  Top Layer w0.5: C6.2 27.6,8.2 USB1.A4B9 ; v1(32.5,54.5) D2.5 ; v1(30,12.5) D1.5 ; USB1.B4A9 32.4,8.39 32.75,8.74 33.5,8.74 34,9.24 C7.2
  Top Layer w0.6: U1.1 C1.2 20.95,4.55 TP1.1 ; v1(29.4,52.75) R9.2
  Top Layer w0.9: TP1.1 v1(30,4.5) 36.1,4.5 C5.1
  Bottom Layer w0.3: v1(35.25,10) v1(37.25,12)
  Bottom Layer w0.6: v1(30,4.5) v1(30,5.5) v1(30,12.5) 30,14.65 v1(29.4,15.25) v1(29.4,47.5) v1(29.4,52.75) 31.15,54.5 v1(32.5,54.5)
  vias: v1(28.75,5.5) v1(28.75,4.5) v1(31.25,5.5) v1(31.25,4.5)
CAN_1_H_1: length 11.5
  Top Layer w0.224: U9.7 13.87,46.86 R34.2 12.17,45.33 C41.2 7.62,45.33 D7.2 6.07,46.88 CN2.2
CAN_1_H_2: length 11.5
  Top Layer w0.224: CN3.2 6.07,11.88 D8.2 7.62,10.33 C46.2 9.58,10.25 12.25,10.25 R36.2 13.87,11.87 U10.7
CAN_1_L_1: length 11.5
  Top Layer w0.224: U9.6 13.87,48.14 R35.1 12.17,49.67 C45.1 7.62,49.67 D7.1 6.07,48.12 CN2.1
CAN_1_L_2: length 11.5
  Top Layer w0.224: U10.6 13.87,13.14 R37.1 12.17,14.67 C50.1 7.62,14.67 D8.1 6.07,13.12 CN3.1
CAN_2_H_1: length 11.5
  Top Layer w0.224: U11.7 46.13,48.14 R38.2 47.83,49.67 C51.2 52.38,49.67 D9.2 53.93,48.12 CN4.2
CAN_2_H_2: length 11.5
  Top Layer w0.252: U12.7 46.13,13.14 R40.2 52.3,14.75 D10.2 53.9,13.45 54.22,13.12 CN5.2
CAN_2_L_1: length 11.5
  Top Layer w0.224: CN4.1 53.93,46.88 D9.1 52.38,45.33 C55.1 47.83,45.33 R39.1 46.13,46.86 U11.6
CAN_2_L_2: length 11.5
  Top Layer w0.224: R41.1 47.83,10.33 C60.1 52.38,10.33 D10.1
  Top Layer w0.252: U12.6 46.13,11.87 R41.1 ; CN5.1 54.22,11.88 53.9,11.55 D10.1
DN_N: length 4.9
  Top Layer w0.347: USB1.A7 30.25,8.22 30.03,8.44 29.47,8.44 29.25,8.22 29.25,7.46 ; USB1.B7 29.25,9.4 D1.1
DP_P: length 4.9
  Top Layer w0.347: 30.75,7.46 30.75,6.7 30.53,6.49 29.97,6.49 29.75,6.7 USB1.A6 ; USB1.B6 30.75,9.4 D1.3
FE11S_DM1: length 19.1
  Top Layer w0.29: v1(28.47,26.22) 28.47,25.63 28.34,25.5 28.34,24.36 28.41,24.29 U3.10 ; 20.62,37.06 20.62,37.65 20.25,38.02 MCU_1.33
  Bottom Layer w0.29: v1(28.47,26.22) 28.47,26.81 28.34,26.94 28.34,28.2 20.49,36.05 20.49,36.99 v1(20.5,37)
FE11S_DM2: length 22.9
  Top Layer w0.29: U3.8 29.68,21.96 29.61,21.89 29.61,21.6 30.47,20.74 32,20.74 32.13,20.87 v1(32.72,20.87) ; v1(39.75,28.5) 39.75,30.25
  Bottom Layer w0.29: v1(39.75,28.5) 39.75,27.91 39.88,27.78 39.88,21.87 38.75,20.74 37.35,20.74 37.15,20.95 37.15,21.64 36.94,21.85 35.83,21.85 35.62,21.64 35.62,20.95 35.42,20.74 33.44,20.74 33.31,20.87 v1(32.72,20.87)
FE11S_DM3: length 36.5
  Top Layer w0.29: v1(32.87,51.25) 32.87,51.62 33.45,52.2 D2.3 D2.4 33.45,56.3 33.13,56.62 32.72,56.62 32.25,57.09 USB2.A7 ; U3.6 30.95,24.29 30.88,24.36 30.88,25.53 31.01,25.66 v1(31.01,26.25)
  Bottom Layer w0.29: v1(32.87,51.25) 32.87,50.66 32.74,50.53 32.74,49.3 30.88,47.43 30.88,26.97 31.01,26.84 v1(31.01,26.25)
FE11S_DP1: length 19.1
  Top Layer w0.29: v1(27.72,26.22) 27.72,25.63 27.85,25.5 27.85,24.36 27.78,24.29 U3.11 ; MCU_1.34 19.75,37.77 19.75,37.77 v1(19.75,37)
  Bottom Layer w0.29: v1(19.75,37) 19.75,36.1 27.85,28 27.85,26.94 27.72,26.81 v1(27.72,26.22)
FE11S_DP2: length 22.9
  Top Layer w0.29: U3.9 29.05,21.96 29.12,21.89 29.12,21.39 30.26,20.25 32,20.25 32.13,20.12 v1(32.72,20.12) ; v1(40.5,28.5) 40.5,29.09 40.25,29.34 MCU_2.34
  Bottom Layer w0.29: v1(40.5,28.5) 40.5,27.91 40.37,27.78 40.37,21.67 38.95,20.25 33.44,20.25 33.31,20.12 v1(32.72,20.12)
FE11S_DP3: length 36.3
  Top Layer w0.29: U3.7 30.32,24.29 30.39,24.36 30.39,25.53 30.26,25.66 v1(30.26,26.25) ; USB2.A6 31.75,56.05 31.55,55.85 D2.6 31,55.1 31,53.9 D2.1 31.55,52.2 32.12,51.63 v1(32.12,51.25)
  Bottom Layer w0.29: v1(32.12,51.25) 32.12,50.66 32.25,50.53 32.25,49.5 30.39,47.64 30.39,26.97 30.26,26.84 v1(30.26,26.25)
FE11S_XIN: length 4.4
  Top Layer w0.25: X1.3 33.83,25.58 C11.2
  Top Layer w0.3: U3.3 32.86,24.14 32.25,24.75 C11.2
FE11S_XOUT: length 7.5
  Top Layer w0.25: U3.2 33.49,23.99 34,24.5 34.55,24.5 35,24.95 35,26.5 35.85,27.35 X1.1 36.17,27.42 C12.2
FE11S_XRSTJ: length 2.8
  Top Layer w0.25: R6.2 26.4,28.93 25.08,30.25 MCU_1.12
MCU_1_BOOT0: length 2.8
  Top Layer w0.25: R11.1 15.75,33.75 16.25,33.25 MCU_1.45
MCU_1_CAN_RX_1: length 21.5
  Top Layer w0.25: MCU_1.42 15.5,34.75
  Top Layer w0.3: 15.5,34.75 14.72,35.53 14.72,41.97 17.5,44.75 17.5,48.25 18.66,49.41 U9.4 21.66,49.41 TP6.1
MCU_1_CAN_RX_2: length 5.8
  Top Layer w0.3: 17.5,16.51 17.5,15.5 18.59,14.41 U10.4 21.66,14.41 TP10.1
MCU_1_CAN_TX_1: length 16.4
  Top Layer w0.25: MCU_1.43 18.5,34.25
  Top Layer w0.3: TP4.1 21.66,45.59 U9.1 20.1,44.6 17.25,41.75 17.25,38.75 19,37 19,34.75 18.5,34.25
MCU_1_CAN_TX_2: length 32.1
  Top Layer w0.25: MCU_1.41 16,35.25 v1(15.75,35.5)
  Top Layer w0.3: TP8.1 21.66,10.59 U10.1 17.91,10.59 17.5,11 v1(17.5,13.59)
  Bottom Layer w0.3: v1(15.75,35.5) 14.75,34.5 14.75,20.25 17.5,17.5 v1(17.5,13.59)
MCU_1_LPUART1_RX: length 15.2
  Top Layer w0.25: v1(22.5,32.25) 23,32.25 23.75,31.5 MCU_1.11
  Top Layer w0.3: R15.1 v1(15.75,26.25)
  Bottom Layer w0.3: v1(22.5,32.25) 22.5,31.25 18.75,27.5 17.5,27.5 16.25,26.25 v1(15.75,26.25)
MCU_1_LPUART1_TX: length 13.6
  Top Layer w0.25: MCU_1.10 23.25,30.95 22.7,31.5 22.2,31.5 21.5,32.2 v1(21.5,32.25)
  Top Layer w0.3: R14.1 v1(15.75,27.5)
  Bottom Layer w0.3: v1(15.75,27.5) 16,27.5 17.5,29 18.75,29 21.5,31.75 v1(21.5,32.25)
MCU_1_NRST: length 11.3
  Top Layer w0.25: v1(20.5,32.25) 20.5,32.2 21.75,30.95 MCU_1.7
  Top Layer w0.3: v1(16.75,31) 14.5,28.75 R16.1
  Bottom Layer w0.3: v1(20.5,32.25) 18,32.25 v1(16.75,31)
MCU_1_OSC_IN: length 7.1
  Top Layer w0.25: MCU_1.5 20.75,29.25 20.5,29 19,29 18.75,28.75 18.75,26.75 ; C26.2 19.88,26.67 X2.1
MCU_1_OSC_OUT: length 4.1
  Top Layer w0.25: MCU_1.6 21.25,29.25 21.5,29 24.18,29 R21.2
MCU_1_SWCLK: length 4.8
  Top Layer w0.25: MCU_1.38 16.55,36.75 15.72,37.59 v1(15.72,37.72)
  Top Layer w0.3: R20.1 v1(13.75,37.75)
  Bottom Layer w0.3: v1(15.72,37.72) 15.68,37.75 v1(13.75,37.75)
MCU_1_SWDIO: length 5.2
  Top Layer w0.25: MCU_1.37 17.25,37.5 v1(15.75,39)
  Top Layer w0.3: R19.1 v1(13.75,39)
  Bottom Layer w0.3: v1(13.75,39) v1(15.75,39)
MCU_1_SWO: length 26.2
  Top Layer w0.25: MCU_1.40 16.5,35.75 v1(15.75,36.5)
  Top Layer w0.3: R18.1 v1(13.75,36.5) ; K1.1 16.51,17.49 v1(13.5,20.5)
  Bottom Layer w0.3: v1(15.75,36.5) v1(13.75,36.5) 13.25,36 13.25,20.75 v1(13.5,20.5)
MCU_1_T_NRST: length 14.1
  Top Layer w0.3: H1.1 5.32,22.93 R10.1 4.75,25.07 4.75,27 5.21,27.46 J1.12 8.06,27.46 D3.4 9.35,28.75 R16.2 12.33,28.76 C24.2
MCU_1_T_SWCLK: length 10.9
  Top Layer w0.3: R20.2 10.5,37.75 9.5,36.75 9.5,32.6 D4.5 8.17,31.27 J1.6
MCU_1_T_SWDIO: length 11.3
  Top Layer w0.3: R19.2 9.75,39 8.75,38 D4.4 8.14,32.54 J1.4
MCU_1_T_SWO: length 10.8
  Top Layer w0.3: R18.2 11.75,36.18 11.75,32.25 11.35,31.85 D4.1 8.9,30 J1.8
MCU_1_T_VCP_RX: length 11.4
  Top Layer w0.3: J1.13 2.75,25.5 3,25.25 v1(3.25,25.25) ; R14.2 11.67,26.85 D3.1 9.9,26.85 v1(9.75,27)
  Bottom Layer w0.3: v1(3.25,25.25) 8,25.25 v1(9.75,27)
MCU_1_T_VCP_TX: length 8.1
  Top Layer w0.3: 7,26.25 7.6,26.85 D3.5 ; 7,26.25 R15.2 ; 7,26.25 6.25,26.25
MCU_2_BOOT0: length 1.6
  Top Layer w0.25: R23.1 MCU_2.45
MCU_2_CAN_RX_1: length 17.9
  Top Layer w0.25: 41.25,34.25 MCU_2.42
  Top Layer w0.3: TP14.1 38.34,45.59 U11.4 41.16,45.59 43.5,43.25 43.5,39.5 40.95,36.95 40.95,34.55 41.25,34.25
MCU_2_CAN_RX_2: length 15.5
  Top Layer w0.3: U12.4 37.41,10.59 36.5,11.5 36.5,15.5 37.5,16.5 42.2,16.5 42.5,16.8 K2.2
MCU_2_CAN_TX_1: length 24
  Top Layer w0.25: MCU_2.43 46.25,34.75
  Top Layer w0.3: TP12.1 38.34,49.41 U11.1 41.84,49.41 43,48.25 43,45.5 46.75,41.75 46.75,35.25 46.25,34.75
MCU_2_CAN_TX_2: length 29
  Top Layer w0.25: 46,33.75 MCU_2.41
  Top Layer w0.3: 46,33.75 46.75,33 46.75,18.5 42.66,14.41 U12.1 38.34,14.41 TP16.1
MCU_2_LPUART1_RX: length 4.3
  Top Layer w0.25: MCU_2.11 36.25,37.75 36,37.5 35.5,37.5
  Top Layer w0.3: 35.5,37.5 34.5,38.5 33.57,38.5 R28.1
MCU_2_LPUART1_TX: length 14.7
  Top Layer w0.25: v1(36.75,37.25) MCU_2.10
  Top Layer w0.3: R30.1 v1(48.5,37.75)
  Bottom Layer w0.3: v1(48.5,37.75) 47.75,37.75 47,37 37,37 v1(36.75,37.25)
MCU_2_NRST: length 14.8
  Top Layer w0.25: MCU_2.7 v1(38.25,36)
  Top Layer w0.3: v1(48.5,34.75) 49,35.25 R29.1
  Bottom Layer w0.3: v1(48.5,34.75) 39.5,34.75 v1(38.25,36)
MCU_2_OSC_IN: length 7.2
  Top Layer w0.25: MCU_2.5 39.25,39.75 39.5,40 41,40 41.25,40.25 C39.2 40.12,42.33 X3.1
MCU_2_OSC_OUT: length 4.1
  Top Layer w0.25: R33.2 35.82,40 38.5,40 38.75,39.75 MCU_2.6
MCU_2_SWCLK: length 8
  Top Layer w0.25: v1(44.25,32.5) 43.7,32.5 43.45,32.25 MCU_2.38
  Top Layer w0.3: R32.1 v1(48.5,30)
  Bottom Layer w0.3: v1(48.5,30) 47,30 44.5,32.5 44.25,32.5
MCU_2_SWDIO: length 8.1
  Top Layer w0.25: MCU_2.37 44,31.75 v1(44.25,31.5)
  Top Layer w0.3: R31.1 v1(48.5,28.75)
  Bottom Layer w0.3: v1(48.5,28.75) 47,28.75 v1(44.25,31.5)
MCU_2_SWO: length 23.3
  Top Layer w0.25: MCU_2.40 45,33.25 v1(45.5,32.75)
  Top Layer w0.3: R27.1 49.59,31.25 v1(48.5,31.25) ; v1(45.5,32.75) 45.5,21.25 43.5,19.25 43.5,17.99 K2.1
  Bottom Layer w0.3: v1(48.5,31.25) 47,31.25 v1(45.5,32.75)
MCU_2_T_NRST: length 19.9
  Top Layer w0.3: C37.2 50.43,36.49 R29.2 50.43,32.92 50.75,32.6 D5.4 53.69,32.6 J2.12 54.75,32.54 55.15,32.14 55.15,25.64 54.79,25.29 54,25.29 53.82,25.11 R22.1 53.82,23.18 54.3,22.7 54.82,22.7 H3.1
MCU_2_T_SWCLK: length 6.3
  Top Layer w0.3: J2.6 53.23,28.73 51.9,27.4 D6.5 51.25,29.75 51,30 R32.2
MCU_2_T_SWDIO: length 6.4
  Top Layer w0.3: J2.4 53.21,27.46 51.85,26.1 D6.4 50.65,26.1 50.43,26.32 R31.2
MCU_2_T_SWO: length 6
  Top Layer w0.3: D5.3 49.9,32.6 50.47,32.03 R27.2 51.01,31.24 52.25,30 J2.8
MCU_2_T_VCP_RX: length 10.9
  Top Layer w0.3: R30.2 51.25,37.75 52.1,36.9 52.1,34.75 ; 52.1,34.75 55.75,34.75 56.69,33.81 J2.13 ; 52.1,34.75 D5.5
MCU_2_T_VCP_TX: length 27.3
  Top Layer w0.3: v1(48.25,33.75) 48.4,33.9 D5.1 ; J2.14 52.56,33.81 v1(52.25,33.5) ; R28.2 v1(33.5,40.25)
  Bottom Layer w0.3: v1(52.25,33.5) 52,33.75 v1(48.25,33.75) 36.25,33.75 33.5,36.5 v1(33.5,40.25)
USB_D+: length 8.7
  Top Layer w0.347: D1.4 30.95,12.78 30.28,13.46 30.28,14.03 29.71,14.6 28.13,14.6 26.51,16.22 U3.16
USB_D-: length 8.8
  Top Layer w0.347: D1.6 29.05,12.78 29.72,13.46 29.72,13.8 29.48,14.05 27.9,14.05 25.87,16.08 U3.15
$3N8127: length 1.2
  Top Layer w0.3: R8.2 25.75,23.25 U3.14
$3N8300: length 23.8
  Top Layer w0.3: 23,19.32 21.02,19.32 SW1.1 19.2,19.3 18.25,20.25 TP3.1 ; 23,19.32 R5.1 26.83,19.32 27.14,19 U3.17 ; 23,19.32 23,23.75 23.5,24.25 25.5,24.25 26.5,25.25 R6.1 ; 23,19.32 C13.2
$3N9166: length 2.1
  Top Layer w0.3: U3.26 32.86,16.89 33.25,16.5 R4.2
$3N10248: length 5.5
  Top Layer w0.3: R7.1 24.68,18.18 v1(25,18.5) ; U3.18 27.78,19.22 v1(27.5,19.5)
  Bottom Layer w0.3: v1(25,18.5) 26,19.5 v1(27.5,19.5)
$3N19788: length 2.8
  Top Layer w0.3: R3.2 32.5,9.25 31.75,8.5 USB1.B5
$3N19847: length 3.1
  Top Layer w0.3: USB1.A5 28.75,8.25 27.5,9.5 R2.1
$3N24491: length 3.4
  Top Layer w0.3: R9.1 29.75,55.25 31.25,56.75 USB2.A5
$6N2708: length 2.9
  Top Layer w0.25: R21.1 C27.2
  Top Layer w0.3: X2.3 22.82,28.07 R21.1
$6N3661: length 10.5
  Top Layer w0.3: v1(8,35.5) R12.2 6.18,36.2 H2.2 ; R11.2 v1(12.5,33.75)
  Bottom Layer w0.3: v1(12.5,33.75) 9.75,33.75 v1(8,35.5)
$6N4541: length 4.4
  Top Layer w0.3: J1.11 2.75,27.46 3.79,27.46 4.25,27 4.25,25.07 R13.2
$6N15318: length 25.2
  Top Layer w0.25: 21.75,37.5 MCU_1.30
  Top Layer w0.3: 21.75,37.5 21.75,34.75 16.51,29.51 16.51,19.49 18.49,17.51 K1.3
$6N22154: length 1.3
  Top Layer w0.3: R17.1 27.99,43.43 U6.2
$6N22191: length 5
  Top Layer w0.25: MCU_1.25 24.25,40.25
  Top Layer w0.3: R17.2 26.57,42.57 24.25,40.25
$7N3652: length 2.7
  Top Layer w0.3: R35.2 11.51,47.5 11.5,47.5 ; 11.5,47.5 C44.2 ; 11.5,47.5 R34.1
$7N4592: length 2.7
  Top Layer w0.3: R37.2 11.5,12.5 ; 11.5,12.5 R36.1 ; 11.5,12.5 C49.2
$7N5135: length 2.7
  Top Layer w0.3: C54.2 48.5,47.5 ; 48.5,47.5 R38.1 ; 48.5,47.5 R39.2
$7N5660: length 2.7
  Top Layer w0.3: 48.5,12.5 R41.2 ; 48.5,12.5 R40.1 ; 48.5,12.5 C59.2
$8N1903: length 1.4
  Top Layer w0.3: R1.2 LED1.2
$11N2708: length 2.9
  Top Layer w0.25: R33.1 C40.2
  Top Layer w0.3: X3.3 37.18,40.93 R33.1
$11N3661: length 12.5
  Top Layer w0.3: H4.2 53.82,36.2 R24.2 ; v1(46,35.75) R23.2
  Bottom Layer w0.3: v1(46,35.75) 51.25,35.75 52.75,37.25 H4.2
$11N4541: length 5.8
  Top Layer w0.3: J2.11 57.25,32.54 58.54,32.54 58.75,32.75 58.75,35.25 58.5,35.5 R25.2
$11N20046: length 13.6
  Top Layer w0.25: MCU_2.30 38.25,28.75
  Top Layer w0.3: 38.25,28.75 41.51,25.49 K2.3
$11N27268: length 8.1
  Top Layer w0.25: MCU_2.13 32.5,37.25
  Top Layer w0.3: R26.1 33.25,41.46 31.62,39.84 31.62,38.12 32.5,37.25
$11N27273: length 1.3
  Top Layer w0.3: R26.2 32.01,43.43 U8.2

## Copper pours and planes (outline as drawn; the poured copper is in the pictures)
+3V3 on Top Layer: 8.75,2 8.5,2.25 8.5,4.75 8.75,5 14.25,5 15.5,3.75 15.5,2.25 15.25,2
+3V3 on Bottom Layer: 8.75,2 8.5,2.25 8.5,4.75 8.75,5 14.25,5 15.5,3.75 15.5,2.25 15.25,2
GND on Top Layer: 0,56 0.02,56.35 0.07,56.74 0.16,57.13 0.3,57.51 0.46,57.87 0.67,58.21 0.9,58.53 1.17,58.83 1.47,59.1 1.79,59.33 2.13,59.54 2.49,59.7 2.87,59.84 3.26,59.93 3.65,59.98 4,60 56,60 56.35,59.98 56.74,59.93 57.13,59.84 57.51,59.7 57.87,59.54 58.21,59.33 58.53,59.1 58.83,58.83 59.1,58.53 59.33,58.21 59.54,57.87 59.7,57.51 59.84,57.13 59.93,56.74 59.98,56.35 60,56 60,4 59.98,3.65 59.93,3.26 59.84,2.87 59.7,2.49 59.54,2.13 59.33,1.79 59.1,1.47 58.83,1.17 58.53,0.9 58.21,0.67 57.87,0.46 57.51,0.3 57.13,0.16 56.74,0.07 56.35,0.02 56,0 4,0 3.65,0.02 3.26,0.07 2.87,0.16 2.49,0.3 2.13,0.46 1.79,0.67 1.47,0.9 1.17,1.17 0.9,1.47 0.67,1.79 0.46,2.13 0.3,2.49 0.16,2.87 0.07,3.26 0.02,3.65 0,4
GND on Bottom Layer: 0,56 0.02,56.35 0.07,56.74 0.16,57.13 0.3,57.51 0.46,57.87 0.67,58.21 0.9,58.53 1.17,58.83 1.47,59.1 1.79,59.33 2.13,59.54 2.49,59.7 2.87,59.84 3.26,59.93 3.65,59.98 4,60 56,60 56.35,59.98 56.74,59.93 57.13,59.84 57.51,59.7 57.87,59.54 58.21,59.33 58.53,59.1 58.83,58.83 59.1,58.53 59.33,58.21 59.54,57.87 59.7,57.51 59.84,57.13 59.93,56.74 59.98,56.35 60,56 60,4 59.98,3.65 59.93,3.26 59.84,2.87 59.7,2.49 59.54,2.13 59.33,1.79 59.1,1.47 58.83,1.17 58.53,0.9 58.21,0.67 57.87,0.46 57.51,0.3 57.13,0.16 56.74,0.07 56.35,0.02 56,0 4,0 3.65,0.02 3.26,0.07 2.87,0.16 2.49,0.3 2.13,0.46 1.79,0.67 1.47,0.9 1.17,1.17 0.9,1.47 0.67,1.79 0.46,2.13 0.3,2.49 0.16,2.87 0.07,3.26 0.02,3.65 0,4
GND on Inner1: 0.3,59.7 59.7,59.7 59.7,0.3 0.3,0.3
GND on Inner2: 0.3,59.7 59.7,59.7 59.7,0.3 0.3,0.3
VBUS on Top Layer: 28.25,5.75 28.27,5.85 28.32,5.93 28.4,5.98 28.5,6 31.5,6 31.6,5.98 31.68,5.93 31.73,5.85 31.75,5.75 31.75,4.25 31.73,4.15 31.68,4.07 31.6,4.02 31.5,4 28.5,4 28.4,4.02 28.32,4.07 28.27,4.15 28.25,4.25
VBUS on Bottom Layer: 28.25,5.75 28.27,5.85 28.32,5.93 28.4,5.98 28.5,6 31.5,6 31.6,5.98 31.68,5.93 31.73,5.85 31.75,5.75 31.75,4.25 31.73,4.15 31.68,4.07 31.6,4.02 31.5,4 28.5,4 28.4,4.02 28.32,4.07 28.27,4.15 28.25,4.25

## Text on the board
Top Silkscreen Layer: TP_+3V3 | VTX | NC | DIO | CLK | SWO | RST | +3V3_LED | TP_VBUS | MCU_1 LED | MCU_2 LED | TP_GND | VCC | GND | GD | VRX | BOOT | CAN_1_1 | CAN_1_2 | CAN_2_1 | CAN_2_2
